# EAGLE design kompass5 (EAGLE 4.16)
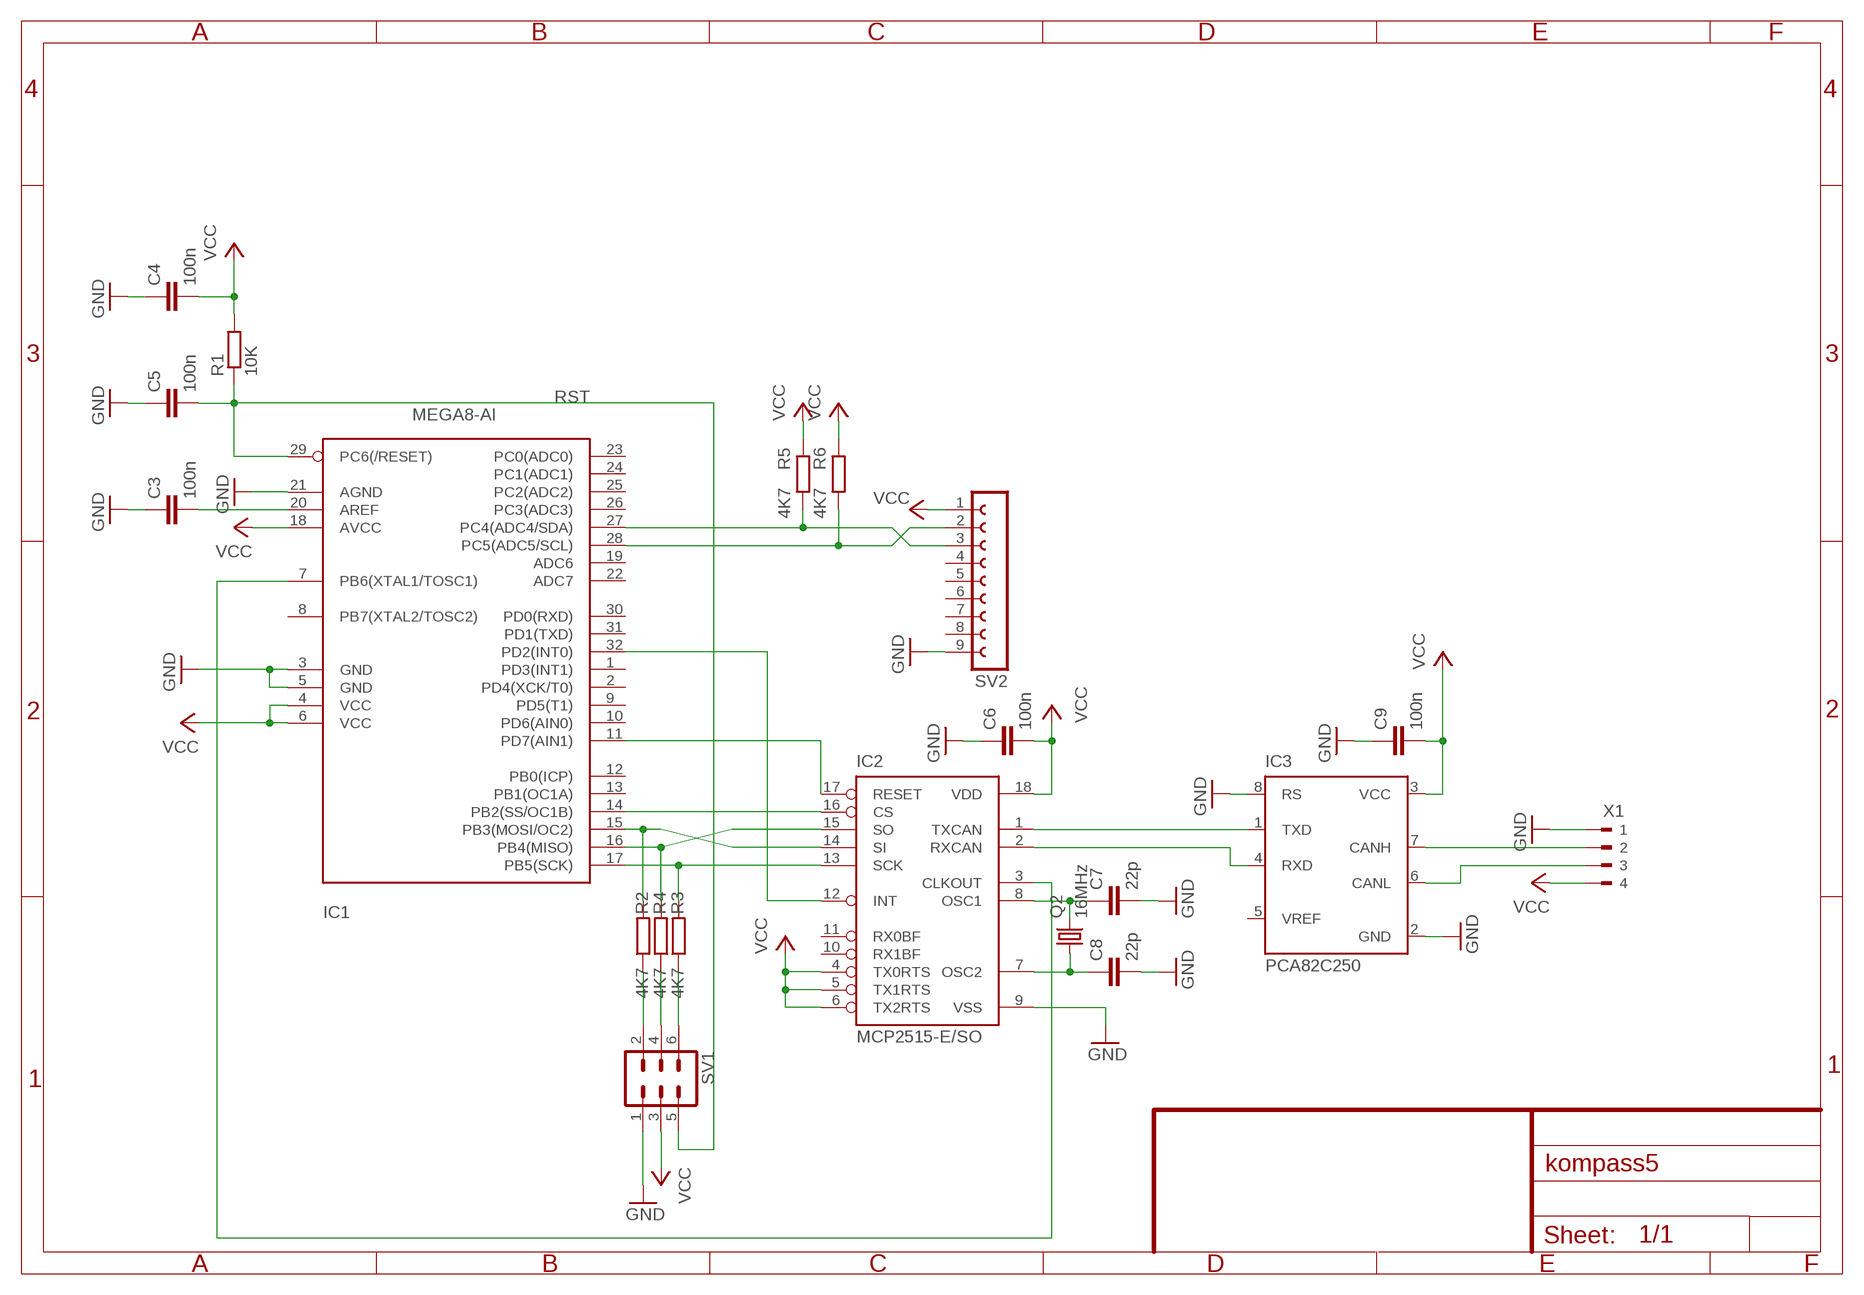
[diagram p0: schematic, sheet 1]

## Parts
C3  100n  C-EUC0603  [C0603]
C4  100n  C-EUC0603  [C0603]
C5  100n  C-EUC0603  [C0603]
C6  100n  C-EUC0603  [C0603]
C7  22p  C-EUC0603  [C0603]
C8  22p  C-EUC0603  [C0603]
C9  100n  C-EUC0603  [C0603]
IC1  MEGA8-AI  [TQFP32-08]
IC2  MCP2515-E/SO  [SO18L]
IC3  PCA82C250  [DIL08]
Q2  16MHz  CRYSTALHC49U-V  [HC49U-V]
R1  10K  R-EU_R0805  [R0805]
R2  4K7  R-EU_R0805  [R0805]
R3  4K7  R-EU_R0805  [R0805]
R4  4K7  R-EU_R0805  [R0805]
R5  4K7  R-EU_R0805  [R0805]
R6  4K7  R-EU_R0805  [R0805]
SV1  MA03-2  [MA03-2]
SV2  FE09-1  [FE09]
X1  90-4  [90-4]

## Nets
GND: C3.1 C4.1 C5.1 C6.1 C7.2 C8.2 C9.1 IC1.3(GND) IC1.5(GND) IC1.21(AGND) IC2.9(VSS) IC3.2(GND) IC3.8(RS) SV1.1 SV2.9 X1.1
INT: IC1.32(PD2(INT0)) IC2.12(INT)
MISO: IC1.16(PB4(MISO)) IC2.15(SO) R4.2
MOSI: IC1.15(PB3(MOSI/OC2)) IC2.14(SI) R2.2
N$1: IC3.7(CANH) X1.2
N$2: IC3.6(CANL) X1.3
N$5: C3.2 IC1.20(AREF)
N$6: IC1.11(PD7(AIN1)) IC2.17(RESET)
N$8: IC1.7(PB6(XTAL1/TOSC1)) IC2.3(CLKOUT)
N$11: IC2.1(TXCAN) IC3.1(TXD)
N$12: IC2.2(RXCAN) IC3.4(RXD)
N$13: C7.1 IC2.8(OSC1) Q2.2
N$14: C8.1 IC2.7(OSC2) Q2.1
N$15: R2.1 SV1.2
N$16: R3.1 SV1.6
N$17: R4.1 SV1.4
RST: C5.2 IC1.29(PC6(/RESET)) R1.1 SV1.5
SCK: IC1.17(PB5(SCK)) IC2.13(SCK) R3.2
SCL: IC1.28(PC5(ADC5/SCL)) R6.1 SV2.2
SDA: IC1.27(PC4(ADC4/SDA)) R5.1 SV2.3
SS: IC1.14(PB2(SS/OC1B)) IC2.16(CS)
VCC: C4.2 C6.2 C9.2 IC1.4(VCC) IC1.6(VCC) IC1.18(AVCC) IC2.4(TX0RTS) IC2.5(TX1RTS) IC2.6(TX2RTS) IC2.18(VDD) IC3.3(VCC) R1.2 R5.2 R6.2 SV1.3 SV2.1 X1.4
Unconnected: IC1.1(PD3(INT1)) IC1.2(PD4(XCK/T0)) IC1.8(PB7(XTAL2/TOSC2)) IC1.9(PD5(T1)) IC1.10(PD6(AIN0)) IC1.12(PB0(ICP)) IC1.13(PB1(OC1A)) IC1.19(ADC6) IC1.22(ADC7) IC1.23(PC0(ADC0)) IC1.24(PC1(ADC1)) IC1.25(PC2(ADC2)) IC1.26(PC3(ADC3)) IC1.30(PD0(RXD)) IC1.31(PD1(TXD)) IC2.10(RX1BF) IC2.11(RX0BF) IC3.5(VREF) SV2.4 SV2.5 SV2.6 SV2.7 SV2.8

## Library data of the parts
C3-C9 = rcl:C-EU: CAPACITOR, European symbol
IC1 = atmel:MEGA8: MICROCONTROLLER 8 Kbytes FLASH 1 kbytes SRAM 512 bytes EEPROM USART 6-channel 10 bit ADC 2-channel 8 bit ADC Source: avr.lbr
IC2 = mcp2515:MCP2515
IC3 = micro-philips:PCA82C250: CAN CONTROLLER INTERFACE
Q2 = crystal:CRYSTAL: CRYSTAL
R1-R6 = rcl:R-EU_: RESISTOR, European symbol
SV1 = con-lstb:MA03-2: PIN HEADER
SV2 = con-lsta:FE09-1: FEMALE HEADER
X1 = con-weidmueller-sl35:90-4: WEIDMUELLER CLAMP CONNECTOR

## Board
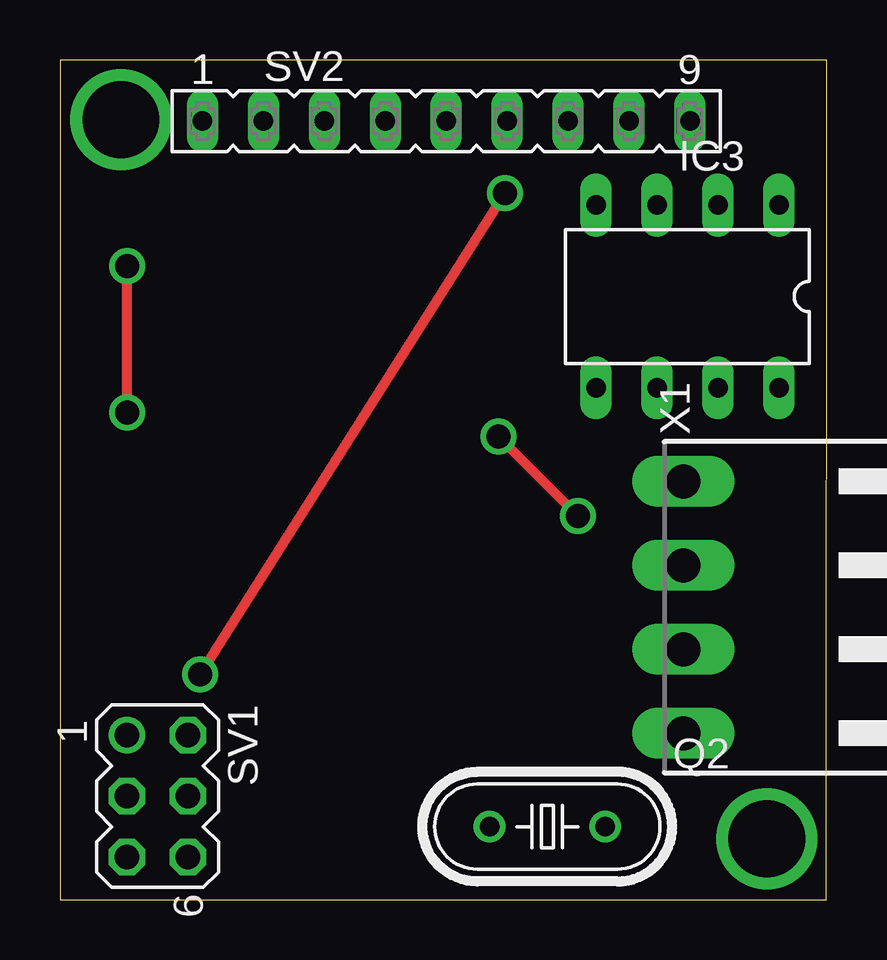
[diagram p1: board, top side]
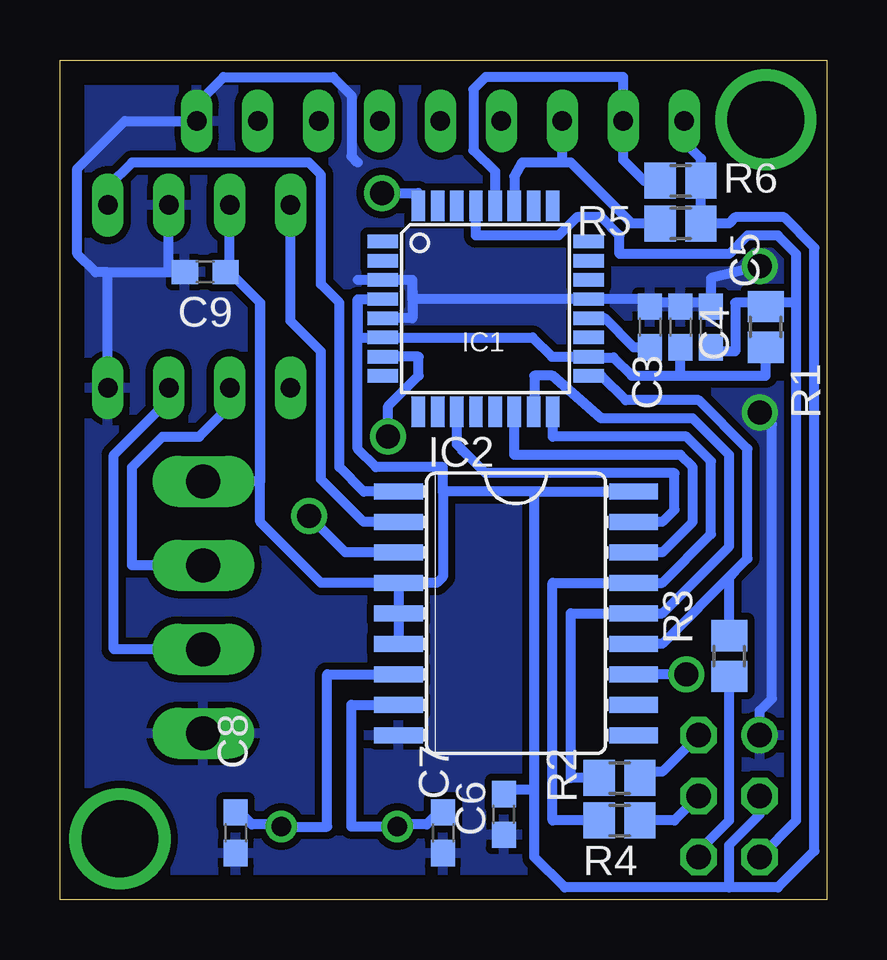
[diagram p2: board, bottom side, seen from below]

Size 31.97 x 35.01 mm. Coordinates in mm from the lower left corner, seen from the top.
Outline: 0,0 31.95,0 31.97,35.01 0,35 0,0
Copper layers (1*16): Top 0.035mm / dielectric 1.5mm / Bottom 0.035mm
Design rules "olimex_8mils": minimum track width 10mil, minimum drill 24mil, track to track 8mil, track to pad 8mil, pad to pad 8mil, via to via 8mil, smd to smd 8mil, copper to edge 40mil, drill to drill 10mil, minimum pad ring 10mil, minimum via ring 8mil, stop-mask expansion 0mil, vias tented up to drill 0mil, thermal gap 10mil

### Footprints (pad centres in the part's own frame; a part is rotated, then mirrored left to right if it is on the bottom)
C0603 = smd 1.1 x 1: 1 -0.85,0; 2 0.85,0
TQFP32-08 = smd 1.27 x 0.559: 1 -4.293,2.8; 2 -4.293,2; 3 -4.293,1.2; 4 -4.293,0.4; 5 -4.293,-0.4; 6 -4.293,-1.2; 7 -4.293,-2; 8 -4.293,-2.8; 17 4.293,-2.8; 18 4.293,-2; 19 4.293,-1.2; 20 4.293,-0.4; 21 4.293,0.4; 22 4.293,1.2; 23 4.293,2; 24 4.293,2.8 | smd 0.559 x 1.27: 9 -2.8,-4.293; 10 -2,-4.293; 11 -1.2,-4.293; 12 -0.4,-4.293; 13 0.4,-4.293; 14 1.2,-4.293; 15 2,-4.293; 16 2.8,-4.293; 25 2.8,4.293; 26 2,4.293; 27 1.2,4.293; 28 0.4,4.293; 29 -0.4,4.293; 30 -1.2,4.293; 31 -2,4.293; 32 -2.8,4.293
SO18L = smd 0.66 x 2.032: 1 -5.08,-4.902; 2 -3.81,-4.902; 3 -2.54,-4.902; 4 -1.27,-4.902; 5 0,-4.902; 6 1.27,-4.902; 7 2.54,-4.902; 8 3.81,-4.902; 9 5.08,-4.902; 10 5.08,4.902; 11 3.81,4.902; 12 2.54,4.902; 13 1.27,4.902; 14 0,4.902; 15 -1.27,4.902; 16 -2.54,4.902; 17 -3.81,4.902; 18 -5.08,4.902
DIL08 = drill 0.813 long: 1 -3.81,-3.81; 2 -1.27,-3.81; 3 1.27,-3.81; 4 3.81,-3.81; 5 3.81,3.81; 6 1.27,3.81; 7 -1.27,3.81; 8 -3.81,3.81
HC49U-V = drill 0.813 round: 1 -2.413,0; 2 2.413,0
R0805 = smd 1.3 x 1.5: 1 -0.85,0; 2 0.85,0
MA03-2 = drill 1.016 round: 1 -2.54,-1.27 | drill 1.016 octagon: 2 -2.54,1.27; 3 0,-1.27; 4 0,1.27; 5 2.54,-1.27; 6 2.54,1.27
FE09 = drill 0.813 long: 1 -10.16,0; 2 -7.62,0; 3 -5.08,0; 4 -2.54,0; 5 0,0; 6 2.54,0; 7 5.08,0; 8 7.62,0; 9 10.16,0
90-4 = drill 1.422 long: 1 -5.25,5.25; 2 -1.75,5.25; 3 1.75,5.25; 4 5.25,5.25

### Placement (x,y rotation side)
C3  7.37,23.87 270 bottom
C4  6.1,23.87 270 bottom
C5  4.83,23.87 270 bottom
C6  13.46,3.55 90 bottom
C7  16,2.79 270 bottom
C8  24.64,2.79 270 bottom
C9  25.91,26.16 0 bottom
IC1  14.22,24.64 0 bottom
IC2  12.95,11.94 270 bottom
IC3  26.16,25.14 180 top
Q2  20.32,3.05 180 top
R1  2.54,23.87 270 bottom
R2  8.64,5.08 180 bottom
R3  4.06,10.16 90 bottom
R4  8.64,3.3 180 bottom
R5  6.1,28.19 0 bottom
R6  6.1,29.97 0 bottom
SV1  4.06,4.32 270 top
SV2  16.1,32.46 0 top
X1  31.24,12.19 90 top

### Tracks (layer width: path | path; a pad name or v marks a point on that pad's centre or on a via)
GND  (via drill 1)
  Top 0.406: v2.79,20.32 v2.79,26.41
  Bottom 0.406: 27.43,26.16 IC3.2 | 27.43,26.16 C9.1 | IC1.5 17.27,24.24 17.27,25.4 | 17.27,25.4 17.27,25.84 IC1.3 19.56,25.84 | 17.27,25.4 17.27,25.04 IC1.21 7.22,25.04 | 6.1,24.89 4.83,24.89 C5.1 4.83,25.91 v2.79,26.41 | C3.1 7.37,24.89 6.1,24.89 | 6.1,24.89 C4.1 | 29.97,26.16 27.43,26.16 | 29.97,26.16 30.48,26.16 31.24,26.92 31.24,30.48 29.26,32.46 SV2.9 26.26,33.17 25.15,34.29 20.57,34.29 19.81,33.53 19.81,30.99 19.56,30.73 | IC3.8 29.97,26.16 | 24.98,6.94 X1.1 | SV1.1 2.79,7.87 2.29,8.38 2.29,19.81 v2.79,20.32
  pour Bottom (isolate 0.305): -0.25,-0.26 32.26,-0.26 32.26,35.3 -0.25,35.3
INT  (via drill 1)
  Top 0.406: v5.84,9.4 v18.54,29.46
  Bottom 0.406: IC1.32 17.02,29.46 v18.54,29.46 | 8.13,9.4 IC2.12 v5.84,9.4
MISO
  Bottom 0.406: IC1.16 11.42,19.3 5.84,19.3 4.83,18.29 4.83,15.24 6.86,13.21 IC2.15 11.43,13.21 11.43,3.3 R4.2
MOSI
  Bottom 0.406: IC1.15 12.22,20.85 12.19,20.83 12.19,21.84 11.43,21.84 9.4,20.06 5.59,20.06 4.06,18.54 4.06,14.73 6.86,11.94 IC2.14 10.67,11.94 10.67,5.08 R2.2
N$1
  Bottom 0.406: X1.2 29.72,10.44 29.72,18.54 27.43,20.83 IC3.7
N$2
  Bottom 0.406: X1.3 28.96,13.94 28.96,18.03 27.69,19.3 26.16,19.3 24.89,20.57 IC3.6
N$3  (via drill 3.2)
  other vias: 2.54,32.51
N$4  (via drill 3.2)
  other vias: 29.46,2.54
N$5
  Bottom 0.406: IC1.20 9.25,24.24 8.04,23.02 C3.2
N$6
  Bottom 0.406: IC2.17 6.86,15.75 6.35,16.25 6.35,17.78 14.22,17.78 14.99,18.54 | 14.99,18.54 15.24,18.79 | IC1.11 15.42,18.98 14.99,18.54
N$8  (via drill 1)
  Top 0.406: v21.59,16 v18.29,19.3
  Bottom 0.406: IC1.7 17.02,22.64 17.02,21.84 18.29,20.57 v18.29,19.3 | v21.59,16 20.07,14.48 IC2.3
N$11
  Bottom 0.406: IC2.1 19.3,17.02 20.32,18.03 20.32,24.89 21.08,25.65 21.08,30.22 21.59,30.73 28.96,30.73 29.97,29.72 IC3.1
N$12
  Bottom 0.406: IC2.2 19.3,15.75 21.08,17.52 21.08,22.86 22.35,24.13 IC3.4
N$13
  Bottom 0.406: 17.78,3.05 17.78,3.13 16.68,3.13 16,3.81 C7.1 | IC2.8 19.81,8.13 19.81,3.05 17.78,3.05 | 17.78,3.05 Q2.2
N$14
  Bottom 0.406: 22.86,3.05 22.86,3.13 23.96,3.13 24.64,3.81 C8.1 | IC2.7 20.83,9.4 20.83,3.05 22.86,3.05 | Q2.1 22.86,3.05
N$15
  Bottom 0.406: R2.1 7.37,5.33 6.86,5.33 SV1.2
N$16
  Bottom 0.406: SV1.6 5.33,2.03 4.06,3.3 4.06,8.89 | 4.06,8.89 R3.1 | R3.1 4.06,9.4 | 4.06,8.89 R3.1
N$17
  Bottom 0.406: SV1.4 6.35,3.3 R4.1
RST
  Bottom 0.406: IC1.29 14.62,27.68 11.18,27.68 10.41,28.45 9.4,28.45 8.64,27.68 8.64,26.92 4.06,26.92 3.3,27.68 2.03,27.68 1.27,26.92 1.27,24.89 | SV1.5 1.27,3.3 1.27,24.89 | C5.2 4.83,22.86 3.81,22.86 3.81,24.89 2.54,24.89 | 2.54,24.89 R1.1 | 1.27,24.89 2.54,24.89
SCK
  Bottom 0.406: IC1.17 9.39,21.84 8.38,20.83 5.33,20.83 3.3,18.79 3.3,14.22 3.81,13.71 | IC2.13 6.86,10.67 3.81,13.71 | R3.2 4.06,13.46 3.81,13.71
SCL
  Bottom 0.406: IC1.28 13.82,30.37 14.73,31.24 14.73,33.78 14.22,34.29 8.48,34.29 SV2.2 8.48,30.83 7.62,29.97 R6.1
SDA
  Bottom 0.406: IC1.27 13.02,30.15 12.7,30.73 11.02,30.73 | 11.02,30.73 SV2.3 | 11.02,30.73 10.67,30.73 8.13,28.19 R5.1
SS
  Bottom 0.406: IC2.16 6.86,14.48 5.59,15.75 5.59,18.03 6.1,18.54 13.02,18.54 IC1.14
VCC
  Bottom 0.406: IC2.4 16.26,13.21 16,13.46 16,17.02 | IC2.4 IC2.5 | IC2.5 17.53,11.94 | IC2.5 IC2.6 17.53,10.67 | 24.89,26.16 IC3.3 | X1.4 23.62,17.44 23.62,24.89 | 24.89,26.16 C9.2 | 23.62,24.89 24.89,26.16 | 19.56,25.04 IC1.4 | 19.56,25.04 19.56,23.44 IC1.6 12.26,23.44 11.46,22.64 IC1.18 9.93,22.6 8.89,22.6 8.13,21.84 6.1,21.84 | 11.94,17.02 IC2.18 | 11.94,17.02 16,17.02 | 16,17.02 16,18.03 18.8,18.03 19.56,18.79 19.56,25.04 | SV2.1 5.89,32.46 5.84,32.51 5.84,31.49 5.25,30.9 R6.2 5.25,28.36 5.08,28.19 | 4.06,0.51 10.92,0.51 12.19,1.78 12.19,4.57 | 4.06,0.51 2.03,0.51 0.51,2.03 0.51,27.18 1.78,28.45 3.81,28.45 4.06,28.19 5.08,28.19 | 4.06,0.51 4.06,2.28 2.79,3.55 SV1.3 | R1.2 2.54,21.84 6.1,21.84 | 6.1,21.84 C4.2 | C6.2 13.3,4.57 12.19,4.57 | 12.19,4.57 12.19,17.02 11.94,17.02 | 5.08,28.19 R5.2 | 23.62,24.89 23.62,15.75 21.08,13.21 IC2.4